# EAGLE design design1 (EAGLE 9.5.1)

## Sheet 1 of 3
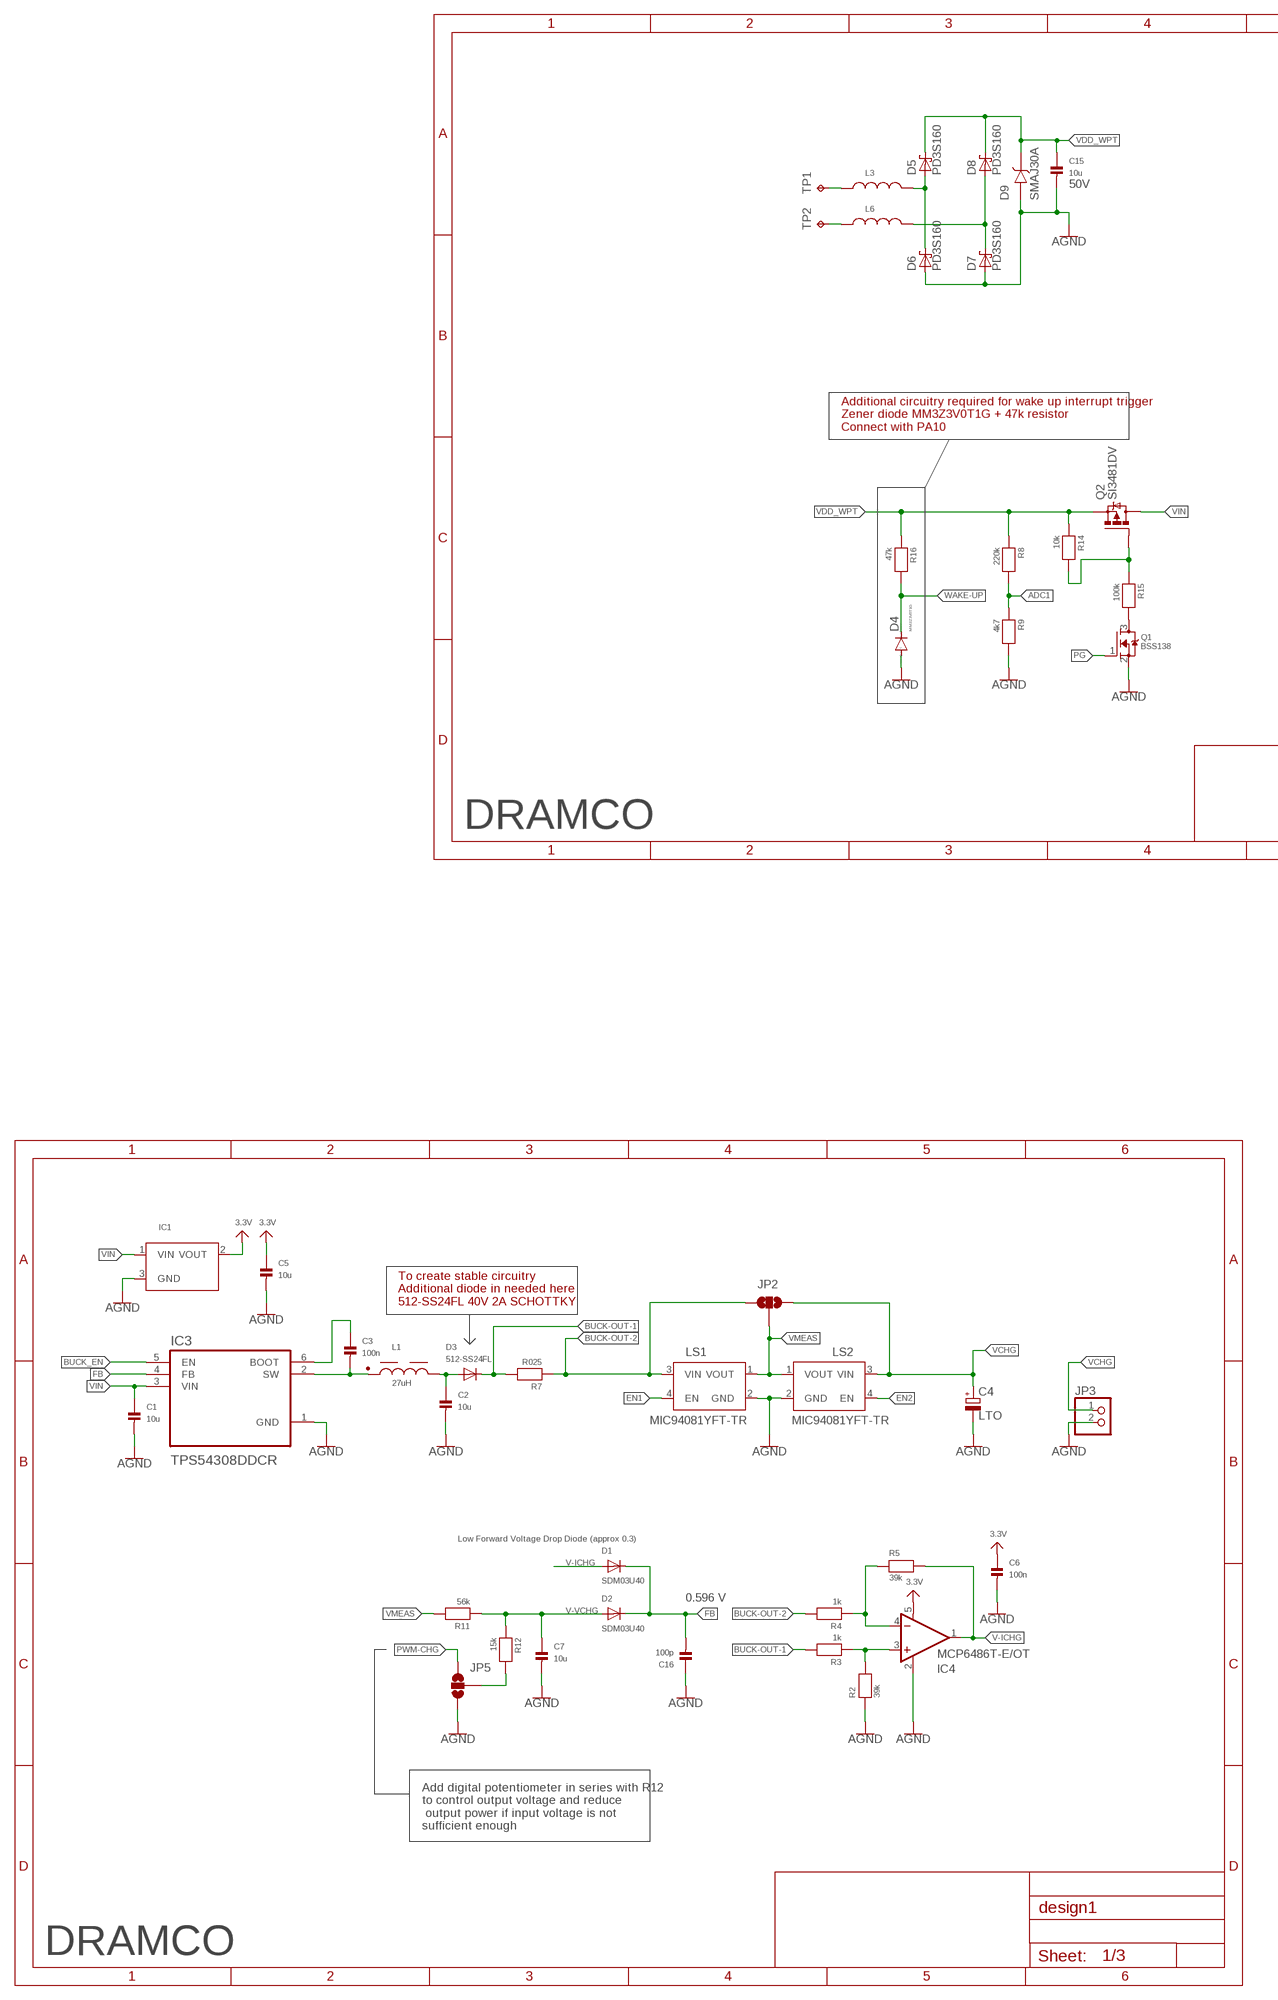
[diagram p0: schematic, sheet 1, part 1 of 2]
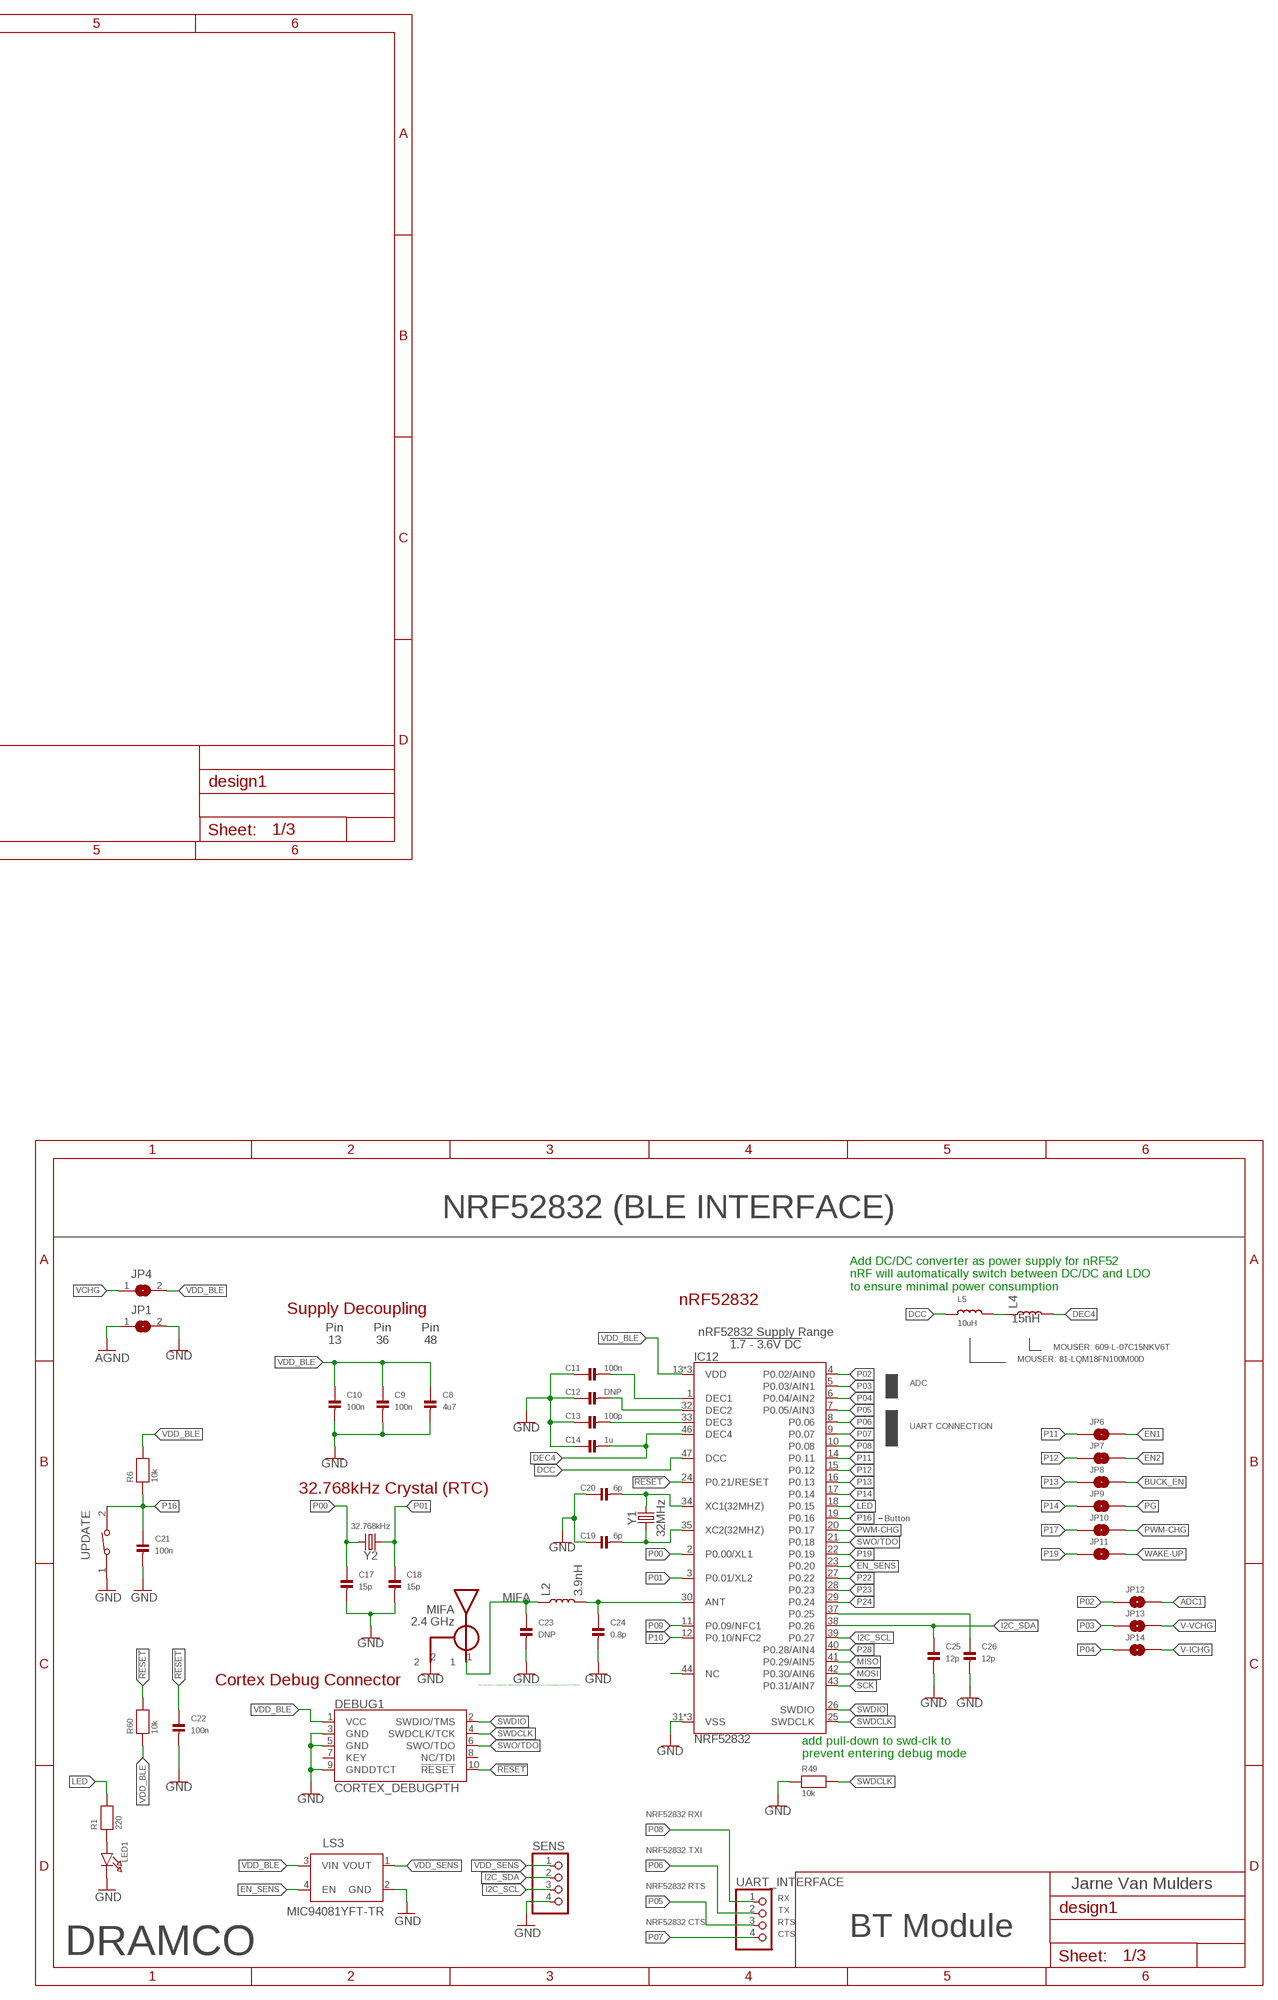
[diagram p1: schematic, sheet 1, part 2 of 2]

### Parts
C1  10u  CAP_CERAMIC0603  [0603]
C2  10u  CAP_CERAMIC0603  [0603]
C3  100n  CAP_CERAMIC0603  [0603]
C4  LTO  CPOL-EUE5-10.5  [E5-10,5]
C5  10u  CAP_CERAMIC0603  [0603]
C6  100n  CAP_CERAMIC0402  [0402]
C7  10u  CAP_CERAMIC0603  [0603]
C8  4u7  CAP_CERAMIC0603  [0603]
C9  100n  CAP_CERAMIC0402  [0402]
C10  100n  CAP_CERAMIC0402  [0402]
C11  100n  CAP_CERAMIC0402  [0402]
C12  DNP  CAP_CERAMIC0402  [0402]
C13  100p  CAP_CERAMIC0402  [0402]
C14  1u  CAP_CERAMIC0402  [0402]
C15  10u  CAP_CERAMIC1206  [1206]
C16  100p  CAP_CERAMIC0603  [0603]
C17  15p  CAP_CERAMIC0402  [0402]
C18  15p  CAP_CERAMIC0402  [0402]
C19  6p  CAP_CERAMIC0402  [0402]
C20  6p  CAP_CERAMIC0402  [0402]
C21  100n  CAP_CERAMIC0402  [0402]
C22  100n  CAP_CERAMIC0402  [0402]
C23  DNP  CAP_CERAMIC0402  [0402]
C24  0.8p  CAP_CERAMIC0402  [0402]
C25  12p  CAP_CERAMIC0402  [0402]
C26  12p  CAP_CERAMIC0402  [0402]
D1  SDM03U40  DIODESOD-523  [SOD-523]
D2  SDM03U40  DIODESOD-523  [SOD-523]
D3  512-SS24FL  DIODESOD-123  [SOD-123]
D4  MM3Z3V0T1G  DIODE-SOD323-R  [SOD323-R]
D5  PD3S160  [POWERDI323]
D6  PD3S160  [POWERDI323]
D7  PD3S160  [POWERDI323]
D8  PD3S160  [POWERDI323]
D9  SMAJ30A  [DIOM5026X229N]
DEBUG1  CORTEX_DEBUGPTH  [2X5-PTH-1.27MM]
IC1  VREG_SOT23  [SOT23-R]
IC3  TPS54308DDCR  [SOT95P280X110-6N]
IC4  MCP6486T-E/OT  MCP6291T-E/OT  [SOT23-5]
IC12  NRF52832  [QFN48-6X6MM]
JP1  SOLDERJUMPERREFLOW_NOPASTE  [SOLDERJUMPER_REFLOW_NOPASTE]
JP2  JUMPER-SMT_3_NO_NO-SILK  [SMT-JUMPER_3_NO_NO-SILK]
JP3  HEADER-1X2ROUND  [1X02_ROUND]
JP4  SOLDERJUMPERREFLOW_NOPASTE  [SOLDERJUMPER_REFLOW_NOPASTE]
JP5  JUMPER-SMT_3_NO_NO-SILK  [SMT-JUMPER_3_NO_NO-SILK]
JP6  JUMPER-SMT_2_NO_NO-SILK  [SMT-JUMPER_2_NO_NO-SILK]
JP7  JUMPER-SMT_2_NO_NO-SILK  [SMT-JUMPER_2_NO_NO-SILK]
JP8  JUMPER-SMT_2_NO_NO-SILK  [SMT-JUMPER_2_NO_NO-SILK]
JP9  JUMPER-SMT_2_NO_NO-SILK  [SMT-JUMPER_2_NO_NO-SILK]
JP10  JUMPER-SMT_2_NO_NO-SILK  [SMT-JUMPER_2_NO_NO-SILK]
JP11  JUMPER-SMT_2_NO_NO-SILK  [SMT-JUMPER_2_NO_NO-SILK]
JP12  JUMPER-SMT_2_NO_NO-SILK  [SMT-JUMPER_2_NO_NO-SILK]
JP13  JUMPER-SMT_2_NO_NO-SILK  [SMT-JUMPER_2_NO_NO-SILK]
JP14  JUMPER-SMT_2_NO_NO-SILK  [SMT-JUMPER_2_NO_NO-SILK]
L1  27uH  WE-PD_7332_PLASTIC_7447789127  [WE-PD_7332/7345_PLASTIC_BASE]
L2  3.9nH  INDUCTOR-0402-3.9NH  [0402]
L3  WE-CAIR_4248_744912182  [WE-CAIR_4248]
L4  15nH  INDUCTOR-0402-3.9NH  [0402]
L5  10uH  INDUCTOR_0603MP  [_0603MP]
L6  WE-CAIR_4248_744912182  [WE-CAIR_4248]
LED1  LED0805  [CHIPLED_0805]
LS1  MIC94081YFT-TR  [IC_MIC94081YFT-TR]
LS2  MIC94081YFT-TR  [IC_MIC94081YFT-TR]
LS3  MIC94081YFT-TR  [IC_MIC94081YFT-TR]
Q1  BSS138  MOSFET-NREFLOW  [SOT23-R]
Q2  SI3481DV  [TSOP-6.PAC]
R1  220  RESISTOR0603  [0603]
R2  39k  RESISTOR0603  [0603]
R3  1k  RESISTOR0603  [0603]
R4  1k  RESISTOR0603  [0603]
R5  39k  RESISTOR0603  [0603]
R6  10k  RESISTOR0402  [0402]
R7  R025  RESISTOR0603  [0603]
R8  220k  RESISTOR0603  [0603]
R9  4k7  RESISTOR0603  [0603]
R11  56k  RESISTOR0603  [0603]
R12  15k  RESISTOR0603  [0603]
R14  10k  RESISTOR0603  [0603]
R15  100k  RESISTOR0603  [0603]
R16  47k  RESISTOR0603  [0603]
R49  10k  RESISTOR0402  [0402]
R60  10k  RESISTOR0402  [0402]
SENS  HEADER-1X4ROUND  [1X04_ROUND]
TP1  TPTP20SQ  [TP20SQ]
TP2  TPTP20SQ  [TP20SQ]
U$18  BLE-ANT  [ANT-2G4]
UART_INTERFACE  HEADER-1X4ROUND  [1X04_ROUND]
UPDATE  434111043826  [434111043826]
Y1  32MHz  CRYSTAL-32MHZ-SMD-2.0X1.6MM  [CRYSTAL-SMD-2.0X1.6MM]
Y2  32.768kHz  CRYSTAL-32.768KHZSMD-3.2X1.5  [CRYSTAL-SMD-3.2X1.5MM]

### Nets
3.3V: C5.1 C6.1 IC1.2(VOUT) IC4.5(V+)
!RESET!: C22.1 DEBUG1.10(!RESET) IC12.24(P0.21/RESET) R60.2
ADC1: JP12.2 R8.2 R9.1
AGND: C1.2 C2.2 C4.- C5.2 C6.2 C7.2 C15.2 C16.1 D4.A D6.A D7.A D9.A IC1.3(GND) IC3.1(GND) IC4.2(V-) JP1.1 JP3.2 JP5.1 LS1.2(GND) LS2.2(GND) Q1.2(S) R2.1 R9.2
ANT: C24.1 IC12.30(ANT) L2.2
BUCK-OUT-1: D3.C R3.2 R7.2
BUCK-OUT-2: JP2.1 LS1.3(VIN) R4.2 R7.1
BUCK_EN: IC3.5(EN) JP8.2
DCC: IC12.47(DCC) L5.1
DEC4: C14.2 IC12.46(DEC4) L4.2
DEC5: C11.2 IC12.1(DEC1)
DEC6: C12.2 IC12.32(DEC2)
DEC8: C13.2 IC12.33(DEC3)
EN1: JP6.2 LS1.4(EN)
EN2: JP7.2 LS2.4(EN)
EN_SENS: IC12.23(P0.20) LS3.4(EN)
FB: C16.2 D1.K(C) D2.K(C) IC3.4(FB)
GND: C8.2 C9.2 C10.2 C11.1 C12.1 C13.1 C14.1 C17.2 C18.2 C19.1 C20.1 C21.2 C22.2 C23.2 C24.2 C25.2 C26.2 DEBUG1.3(GND) DEBUG1.5(GND) DEBUG1.9(GNDDTCT) IC12.31(VSS) IC12.45(VSS) IC12.EP(VSS) JP1.2 LED1.C LS3.2(GND) R49.1 SENS.4 U$18.2 UPDATE.1
I2C_SCL: IC12.39(P0.27) SENS.3
I2C_SDA: C25.1 IC12.38(P0.26) SENS.2
LED: IC12.18(P0.15) R1.2
MIFA: C23.1 L2.1 U$18.1
MISO: IC12.41(P0.29/AIN5)
MOSI: IC12.42(P0.30/AIN6)
N$2: C3.1 IC3.6(BOOT)
N$3: C3.2 IC3.2(SW) L1.1
N$4: Q1.3(D) R15.2
N$5: Q2.3(G) R14.2 R15.1
N$6: JP5.2 R12.2
N$8: IC4.4(-IN) R4.1 R5.1
N$9: IC4.3(+IN) R2.2 R3.1
N$12: L6.1 TP2.TP
N$13: C2.1 D3.A L1.2
N$14: L3.1 TP1.TP
N$15: D5.A D6.C L3.2
N$16: D7.C D8.A L6.2
N$20: LED1.A R1.1
N$50: C26.1 IC12.37(P0.25)
N$53: L4.1 L5.2
NC: IC12.44(NC)
P00: C17.1 IC12.2(P0.00/XL1) Y2.P$2
P01: C18.1 IC12.3(P0.01/XL2) Y2.P$1
P02: IC12.4(P0.02/AIN0) JP12.1
P03: IC12.5(P0.03/AIN1) JP13.1
P04: IC12.6(P0.04/AIN2) JP14.1
P05: IC12.7(P0.05/AIN3) UART_INTERFACE.3
P06: IC12.8(P0.06) UART_INTERFACE.2
P07: IC12.9(P0.07) UART_INTERFACE.4
P08: IC12.10(P0.08) UART_INTERFACE.1
P09: IC12.11(P0.09/NFC1)
P10: IC12.12(P0.10/NFC2)
P11: IC12.14(P0.11) JP6.1
P12: IC12.15(P0.12) JP7.1
P13: IC12.16(P0.13) JP8.1
P14: IC12.17(P0.14) JP9.1
P16: C21.1 IC12.19(P0.16) R6.1 UPDATE.2
P17: JP10.1
P19: IC12.22(P0.19) JP11.1
P22: IC12.27(P0.22)
P23: IC12.28(P0.23)
P24: IC12.29(P0.24)
P28: IC12.40(P0.28/AIN4)
PG: JP9.2 Q1.1(G)
PWM-CHG: IC12.20(P0.17) JP5.3 JP10.2
SCK: IC12.43(P0.31/AIN7)
SWDCLK: DEBUG1.4(SWDCLK/TCK) IC12.25(SWDCLK) R49.2
SWDIO: DEBUG1.2(SWDIO/TMS) IC12.26(SWDIO)
SWO/TDO: DEBUG1.6(SWO/TDO) IC12.21(P0.18)
V-ICHG: D1.A IC4.1(OUT) JP14.2 R5.2
V-VCHG: C7.1 D2.A JP13.2 R11.1 R12.1
VCHG: C4.+ JP2.3 JP3.1 JP4.1 LS2.3(VIN)
VDD_BLE: C8.1 C9.1 C10.1 DEBUG1.1(VCC) IC12.13(VDD) IC12.36(VDD) IC12.48(VDD) JP4.2 LS3.3(VIN) R6.2 R60.1
VDD_SENS: LS3.1(VOUT) SENS.1
VDD_WPT: C15.1 D5.C D8.C D9.C Q2.4(S) R8.1 R14.1 R16.1
VIN: C1.1 IC1.1(VIN) IC3.3(VIN) Q2.1(D) Q2.2(D) Q2.5(D) Q2.6(D)
VMEAS: JP2.2 LS1.1(VOUT) LS2.1(VOUT) R11.2
WAKE-UP: D4.C JP11.2 R16.2
XC1: C20.2 IC12.34(XC1(32MHZ)) Y1.3
XC2: C19.2 IC12.35(XC2(32MHZ)) Y1.1
Unconnected: DEBUG1.7(KEY) DEBUG1.8(NC/TDI)

### Notes on the sheet
- 50V
- Additional circuitry required for wake up interrupt trigger
  Zener diode MM3Z3V0T1G + 47k resistor
  Connect with PA10
- DRAMCO
- NRF52832 (BLE INTERFACE)
- Add DC/DC converter as power supply for nRF52
  nRF will automatically switch between DC/DC and LDO
  to ensure minimal power consumption
- To create stable circuitry
  Additional diode in needed here
  512-SS24FL 40V 2A SCHOTTKY
- nRF52832
- Supply Decoupling
- nRF52832 Supply Range
  !1.7 - 3.6V DC!
- Pin
  13
- Pin
  36
- Pin
  48
- MOUSER: 609-L-07C15NKV6T
- MOUSER: 81-LQM18FN100M00D
- ADC
- UART CONNECTION
- 32.768kHz Crystal (RTC)
- Button
- Low Forward Voltage Drop Diode (approx 0.3)
- 0.596 V
- Cortex Debug Connector | https://www.infineon.com/dgdl/Infineon-AN91445_Antenna_Design_and_RF_Layout_Guidelines-ApplicationNotes-v09_00-EN.pdf
- add pull-down to swd-clk to 
  prevent entering debug mode
- NRF52832 RXI
- Add digital potentiometer in series with R12 
  to control output voltage and reduce
   output power if input voltage is not 
  sufficient enough
- NRF52832 TXI
- NRF52832 RTS | Jarne Van Mulders
- RX
- TX
- NRF52832 CTS | RTS
- CTS | BT Module
- DRAMCO | DRAMCO

## Sheet 2 of 3

## Sheet 3 of 3

## Library data of the parts
C1-C3 C5-C26 = microbuilder:CAP_CERAMIC: Ceramic Capacitors 0402 - 0402 Surface Mount Capacitors 16pF 50V 5% [Digikey: 445-4899-2-ND] 18pF 50V 5% [Digikey: 490-1281-2-ND] 22pF 50V 5% [Digikey: 490-1283-2-ND] 68pF 50V 5% [Digikey: 490-1289-2-ND] 0.1uF 10V 10% [Digikey: 490-1318-2-ND] 1.0uF 6.3V 10% [Digikey: 490-1320-2-ND] 0603 - 0603 Surface Mount Capacitors 16 pF 50V 5% [Digikey: 445-5051-2-ND] 22 pF 50V [Digikey: PCC220ACVTR-ND] 33 pF 50V 5% [Digikey: 490-1415-1-ND] 56pF 50V 5% [Digikey: 490-1421-1-ND] 220pF 50V 5% [Digikey: 445-1285-1-ND] 680 pF 50V 2200 pF 50V 5% C0G [Digikey: 445-1297-1-ND] 5600 pF 100V 5% X7R [Digikey: 478-3711-1-ND] 0.1 µF 25V 10% [Digikey: PCC2277TR-ND] 0.22 µF 16V 10% X7R [Digikey: 445-1318-1-ND] 1.0 µF 25V 10% [Digikey: 445-5146-2-ND] 0603 - RF Specific 3pF 250V +/-0.1pF RF [Digikey: 712-1347-1-ND] 18 pF 250V 5% [Digikey: 478-3505-1-ND or 712-1322-1-ND] 56 pF 250V 5% C0G RF [Digikey: 490-4867-1-ND] 68 pF 250V RF [Digikey: 490-4868-1-ND] 0805 - 0805 Surface Mount Capacitors 220 pF 250V 2% RF Ceramic Capacitor [Digikey: 712-1398-1-ND] 1000 pF 50V 2% NP0 Ceramic Capacitor [Digikey: 478-3760-1-ND] 0.1 µF 25V 10% Ceramic Capacitor [Digikey: PCC1828TR-ND] 1.0 µF 16V 10% Ceramic Capacitor[Digikey: 490-1691-2-ND] 10.0 µF 10V 10% Ceramic Capacitor[Digikey: 709-1228-1-ND] 10.0 uF 16V 10% Ceramic Capacitor [Digikey: 478-5165-2-ND] 47 uF 6.3V 20% Ceramic Capacitor [Digikey: 587-1779-1-ND or 399-5506-1-ND] 1206 - 1206 Surface Mount Capacitors 47uF 10V 20% Ceramic Capacitor [Digikey: 490-5528-1-ND or 399-5508-1-ND or 445-6010-1-ND] 100uF 6.3V -20%, +80% Y5V Ceramic Capacitor (Digikey: 490-4512-1-ND, Mouser: 81-GRM31CF50J107ZE1L)
C4 = rcl:CPOL-EU: POLARIZED CAPACITOR, European symbol
D1-D3 = microbuilder:DIODE: Diode SMA Model Volts Amps Type Vf Vr Digikey # Notes SSA34-E3 40V 3A Schottky 480mV @ 3A 200uA @ 40V SSA34-E3/61TGITR-ND CDBA120-G 20V 1A Schottky 500mV @ 1A 500uA @ 20V 641-1014-6-ND REEL MBRA210 10V 2A Schottky 350mV @ 2A 700uA @ 10V MBRA210LT3 SOD-123 Model Volts Amps Type Vf Vr Order # Notes BAT54T1G 30V 200mA Schottky 800mV @ 200mA 2uA @ 25V BAT54T1GOSTR-ND B0530W 30V 500mA Schottky 430mV @ 500mA 130uA @ 30V B0530W-FDICT-ND REEL MBR120 1A 20V Schottky 340mV @ 1A MBR120VLSFT1GOSCT-ND SOD-323 Model Volts Amps Type Vf Vr Order # Notes PMEG2005EJ 20V 500mA Schottky 355mV @ 500mA 568-4110-1-ND ZLLS410 10V 570mA Schottky 380mV @ 570mA ZLLS410CT-ND 1N4148WS 75V 150mA Silicon/Simple 1V 1N4148WSFSCT-ND REEL SOD-523 Model Volts Amps Type Vf Vr Order # Notes BAT54XV2 30V 200mA Schottky 0.8V @ 100mA BAT54XV2CT-ND TB751S 30V 30mA Schottky RB751S-40TE61CT-ND SOT23-R/W (R = Solder Paste/Reflow Ovens, W = Hand-Soldering) Model Volts Amps Type Vf Vr Order # Notes BAT54FILM 40V 300mA Schottky 497-7162-1-ND
D4 = diode:DIODE-: DIODE
D5-D8 = diode:PD3S160: 1.0A SURFACE MOUNT SCHOTTKY BARRIER RECTIFIER POWERDI ® 323 Source: http://www.diodes.com/datasheets/ds30899.pdf
D9 = SMAJ30A:SMAJ30A: SMAJ Series 48.4 V 0.4 kW Surface Mount Uni-Directional TVS Diode - DO-214AC Check prices <https://pricing.snapeda.com/parts/SMAJ30A/Littelfuse/view-part?ref=eda>; AVAILABILITY: Good; DESCRIPTION: 48.4V Clamp 8.3A Ipp Tvs Diode Surface Mount DO-214AC (SMA); MF: Littelfuse; MP: SMAJ30A; PACKAGE: DO-214 Littelfuse; PRICE: None; PURCHASE-URL: https://pricing.snapeda.com/search/part/SMAJ30A/?ref=eda
DEBUG1 = SparkFun-Connectors:CORTEX_DEBUG: Cortex Debug Connector Datasheet <http://infocenter.arm.com/help/topic/com.arm.doc.faqs/attached/13634/cortex_debug_connectors.pdf>
IC1 = microbuilder:VREG_SOT23: SOT23 Fixed Voltage Regulators Part Current Out V Out V In V Dropout Digikey Part No. AP7313 150mA 3.3V 3.5-6V 0.15V @ 150mA AP7313-33SAG-7DICT-ND
IC3 = TPS54308DDCR:TPS54308DDCR: Check availability <https://pricing.snapeda.com/parts/TPS54308DDCR/Texas%20Instruments/view-part?ref=eda>; AVAILABILITY: In Stock; DESCRIPTION: 4.5-V to 28-V Input, 3-A output, synchronous 350-kHz FCCM step-down converter; MF: Texas Instruments; MP: TPS54308DDCR; PACKAGE: SOT-23-THN-6 Texas Instruments; PRICE: None; PURCHASE-URL: https://pricing.snapeda.com/search/part/TPS54308DDCR/?ref=eda
IC4 = SparkFun-Retired:MCP6291: Rail to rail OpAmp with 10MHz GBP Prototype: IC-11991; PROD_ID: IC-11991; VALUE: MCP6291T
IC12 = SparkFun-RF:NRF52832: Nordic nRF52832 Bluetooth Smart/ANT/2.4GHz RF SoC The nRF52832 SoC is a powerful, highly flexible ultra-low power multiprotocol SoC ideally suited for Bluetooth® Smart ANT and 2.4GHz ultra low-power wireless applications. The nRF52832 SoC is built around a 32-bit ARM® Cortex™-M4F CPU with 512kB + 64kB RAM. The embedded 2.4GHz transceiver supports Bluetooth Smart, ANT and proprietary 2.4 GHz protocol stack. It is on air compatible with the nRF51 Series, nRF24L and nRF24AP Series products from Nordic Semiconductor. Datasheet <https://cdn.sparkfun.com/datasheets/Wireless/Bluetooth/nRF52832_PS_v1.0.pdf> SparkFun Products: SparkFun nRF52832 Breakout <https://www.sparkfun.com/products/13990>; PROD_ID: IC-13460
JP1 JP4 = microbuilder:SOLDERJUMPER: SMD Solder JUMPER Solder the two pads together to create a connection, or remove the solder to break it. REFLOW - Use this footprint for solder paste and reflow ovens. WAVE - Use this footprint for hand-soldering (larger pads). CLOSED - Has a trace between the two pads to ensure it is closed by default. The trace needs to be cut to disable the jumper, and can be closed again by creating a solder bridge between the two pads.
JP2 JP5 = SparkFun-Jumpers:JUMPER-SMT_3_NO: Normally open jumper This jumper has three pads in close proximity to each other. Apply solder to close the connection(s).
JP3 = microbuilder:HEADER-1X2: PIN HEADER
JP6-JP14 = SparkFun-Jumpers:JUMPER-SMT_2_NO: Normally open jumper This jumper has two pads in close proximity to each other. Apply solder to close the connection. Round pads are easier to solder for beginners, but are a lot larger. SparkFun Product that uses the round pads: SparkFun EL Sequencer <https://www.sparkfun.com/products/12781>
L1 = EMCComponents (rev19b):WE-PD_7332_PLASTIC: SMD Shielded Power Inductor Characteristics Magnetically shielded version which results in a low leakage field High Saturation currents up to 25 A Very low self-losses at high switching frequency‘s Wide inductances spectrum available at all sizes Operating temperature: –40 °C to +125 °C Applications Perfectly suitable for switching regulators with extremely high efficiency Integrated DC/DC- converter Switching regulators with low operating voltages (Graphic cards, embedded PC-Cards, Mainboards) Plastic base: Because of the one piece construction these are more suitable for high vibration or shock applications <http://katalog.we-online.de/media/images/v2/Family_WE-PD.jpg> Details see: http://katalog.we-online.de/en/pbs/WE-PD? Updated by Dan Xu 2014-07-08 2014 (C) Wurth Elektronik; WE-NUMBER: 7447789127/27uH
L2 = nrf52832-breakout-temp:INDUCTOR: Inductors; PROD_ID: NDUC-13457
L3 L6 = PowerMagnetics (rev18e):WE-CAIR_4248: WE-CAIR Air coil Characteristics Inductance values from 1.65nH up to 120 nH Very high quality factor >100 High self-resonant frequency High currents up to 3.5 A 5%(10%) Inductance tolerance Pick and place process possible Good solderability (Tinned connector pins) Operating temperature: –40 °C to +125 °C Applications Especially for RF application Ideal for high current applications Broad band filter RF-Decoupling <http://katalog.we-online.de/media/images/v2/Family_WE-CAIR_4C.jpg> Details see: http://katalog.we-online.de/en/pbs/WE-CAIR Created on 2014-05-19 2014 (C) Wurth Elektronik; WE-NUMBER: 744912182/82nH
L4 = nrf52832-breakout-temp:INDUCTOR: Inductors; PROD_ID: NDUC-13457; VALUE: 3.9nH
L5 = microbuilder:INDUCTOR: Inductors
LED1 = microbuilder:LED: LED 0603 - 0603 Surface Mount Package 2mA: Green LED - Low Power (3.9mcd, 2ma, 1.7Vf) - Digikey: 475-2709-2-ND Orange LED - Low Power (9.8mcd, 2ma, 1.8Vf) - Digikey: 475-1194-2-ND Red LED - Low Power (5mcd, 2ma, 1.8Vf) - Digikey: 475-1195-2-ND Yellow LED - Low Power (7mcd, 2ma, 1.8Vf) - Digikey: 475-1196-2-ND 5mA: Blue LED - Low Power (17mcd, 5ma, 2.9Vf) - Digikey: LNJ937W8CRACT-ND 0805 - 0805 Surface Mount Package 2mA: Red LED (8.8mcd, 2mA, 1.8Vf, Clear) - Low Power [Digikey: 475-2510-1-ND] Green LED (5mcd, 2mA, 1.8Vf, Clear) - Low Power [Digikey: 475-2730-1-ND] Yellow LED (11.3mcd, 2mA, 1.8Vf, Clear) - Low Power [Digikey: 475-2555-1-ND] 20mA: Red LED (104mcd, 20mA, Diffused) - LS R976 [Digikey: 475-1278-6-ND] Red LED (12mcd, 20mA, 2.0Vf, Clear) - APT2012EC [Digikey: 754-1128-1-ND] Green LED (15mcd, 20mA, 2.2Vf, Clear) - APT2012GC [Digikey: 754-1131-1-ND] Orange LED (160mcd, 20mA, 2.1Vf, Clear) - APT2012SECK [Digikey: 754-1130-1-ND] 1206 - 1206 Surface Mount Package Green LED (26mcd, 20mA, Diffused) - LG N971 [Digikey: 475-1407-6-ND] Red LED (15mcd, 20mA, Diffused) - LH N974 [Digikey: 475-1416-6-ND]
LS1-LS3 = MIC94081YFT-TR:MIC94081YFT-TR: Power Switch/Driver 1:1 P-Channel 2A 4-TMLF® (0.85x0.85) Check prices <https://pricing.snapeda.com/parts/MIC94081YFT-TR/Microchip/view-part?ref=eda>; AVAILABILITY: In Stock; DESCRIPTION: Power Switch/Driver 1:1 P-Channel 2A 4-TMLF® (0.85x0.85); MF: Microchip; MP: MIC94081YFT-TR; PACKAGE: UFDFN-4 Microchip; PRICE: None
Q1 = microbuilder:MOSFET-N: N-Channel Mosfet LEGEND VDS: Voltage Drain-Source ID: Drain Current RDS(ON): Drain-Source On-State Resistance VGS(TH): Gate-Source Threshold Voltage CISS: Drain-Source Input Capacitance SOT-23 Name VDS ID RDS(ON) VGS(TH) CISS Order Number 2N7002E 60V 260mA 2.5 Ohm 2.5V @ 250uA 26.7pF @ 25V 2N7002ET1GOSTR-ND BSH103 30V 850mA 400 mOhm 400mV @ 1mA 83pF @ 24V BSH103,235-ND BSS138 60V 320mA 1.6 Ohm 1.5V @ 250uA 50pF @ 10V Mouser: 771-BSS138PW115 DMN2075U-7 20V 4.2A 38 mOhm 1V @ 250 uA 594.3pF @ 10V DMN2075U-7DICT-ND * BSS138 good choice for I2C level-shifting
Q2 = transistor-power:SI3481DV: P-Channel 30-V (D-S) MOSFET Source: http://www.vishay.com/docs/72105/72105.pdf
R1-R9 R11 R12 R14-R16 R49 R60 = microbuilder:RESISTOR: Resistors 0402 - 0402 Surface Mount Package 22 Ohm 1% 1/16W [Digikey: 311-22.0LRTR-ND] 33 Ohm 5% 1/16W 1.0K 5% 1/16W 1.5K 5% 1/16W 2.0K 1% 1/16W 10.0K 1% 1/16W [Digikey: 311-10.0KLRTR-ND] 10.0K 5% 1/16W [Digikey: RMCF0402JT10K0TR-ND] 12.1K 1% 1/16W [Digikey: 311-22.0LRTR-ND] 100.0K 5% 1/16W 0603 - 0603 Surface Mount Package 0 Ohm 1/10 Watt 1% Resistor 15 Ohm 1/10 Watt 1% Resistor 33 Ohm 1/10 Watt 1% Resistor 49.9 Ohm 1/10 Watt 1% Resistor 100 Ohm 1/10 Watt 1% Resistor 150 Ohm 1/10 Watt 1% Resistor 240 Ohm 1/10 Watt 1% Resistor 390 Ohm 1/10 Watt 1% Resistor 560 Ohm 1/10 Watt 1% Resistor 680 Ohm 1/10 Watt 1% Resistor 750 Ohm 1/10 Watt 1% Resistor 1.0K Ohm 1/10 Watt 1% Resistor 1.5K Ohm 1/10 Watt 1% Resistor 2.0K Ohm 1/10 Watt 1% Resistor 2.2K Ohm 1/10 Watt 1% Resistor 3.3K Ohm 1/10 Watt 1% Resistor 4.7K Ohm 1/10 Watt 1% Resistor 10.0K Ohm 1/10 Watt 1% Resistor 12.0K Ohm 1/10 Watt 1% Resistor 12.1K Ohm 1/10 Watt 1% Resistor 20.0K Ohm 1/10 Watt 1% Resistor 33.0K Ohm 1/10 Watt 1% Resistor 100.0K Ohm 1/10 Watt 1% Resistor 0805 - 0805 Surface Mount Package 0 Ohm 1/8 Watt 1% Resistor 33 Ohm 1/8 Watt 1% Resistor 100 Ohm 1/8 Watt 1% Resistor 150 Ohm 1/8 Watt 1% Resistor 200 Ohm 1/8 Watt 1% Resistor 240 Ohm 1/8 Watt 1% Resistor 330 Ohm 1/8 Watt 1% Resistor 390 Ohm 1/8 Watt 1% Resistor 470 Ohm 1/8 Watt 1% Resistor 1.0K Ohm 1/8 Watt 1% Resistor 1.5K Ohm 1/8 Watt 1% Resistor 2.0K Ohm 1/8 Watt 1% Resistor 4.7K Ohm 1/8 Watt 1% Resistor 5.1K Ohm 1/8 Watt 1% Resistor 5.6K Ohm 1/8 Watt 1% Resistor 10.0K Ohm 1/8 Watt 1% Resistor 22.0K Ohm 1/8 Watt 1% Resistor 33.0K Ohm 1/8 Watt 1% Resistor 100K Ohm 1/8 Watt 1% Resistor 1206 - 1206 Surface Mount Package 2012 - 2010 Surface Mount Package 0.11 Ohm 1/2 Watt 1% Resistor - Digikey: RHM.11UCT-ND
SENS UART_INTERFACE = microbuilder:HEADER-1X4: PIN HEADER
TP1 TP2 = testpad:TP: Test pad
U$18 = ble-antenna:BLE-ANT
UPDATE = Eagle_SWITCHES (rev18c):434111043826: 6.0x3.5 mm SMD WS-TASV <http://katalog.we-online.de/media/images/v2/Family_WS-TASV_6.0x3.jpg> Details see: http://katalog.we-online.de/em/datasheet/4341x1xxx8x6.pdf 2015 (C) Wurth Elektronik
Y1 = nrf52832-breakout-temp:CRYSTAL-32MHZ: 32MHz Crystal Digikey Example <http://www.digikey.com/product-detail/en/murata-electronics-north-america/XRCGB32M000F2P00R0/490-9769-1-ND/4952013> Frequency: 32MHz Frequency Stability: ±20ppm Frequency Tolerance: ±20ppm Load Capacitance: 6pF; PROD_ID: XTAL-13459
Y2 = SparkFun-Clocks:CRYSTAL-32.768KHZ: 32.768kHz Crystal Frequency: 32.768kHz Frequency Stability: ±20ppm Load Capacitance: 12.5pF (PTH-2X6 & SMD-3.2X1.5), 6pF (SMD-2X6); PROD_ID: XTAL-13062

## Board
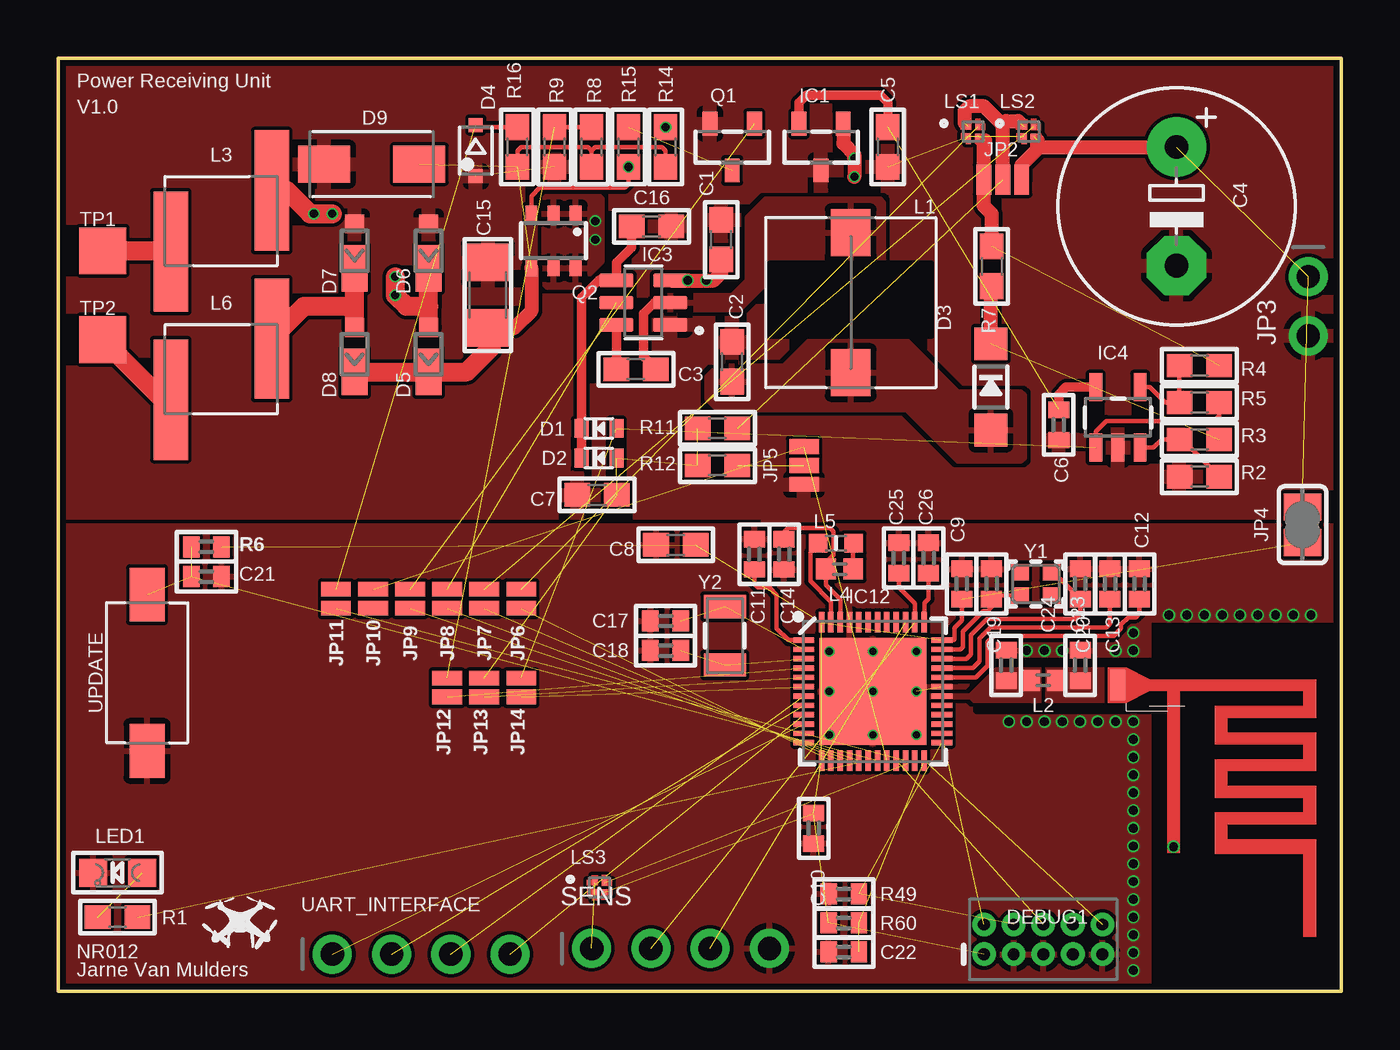
[diagram p2: board, top side]
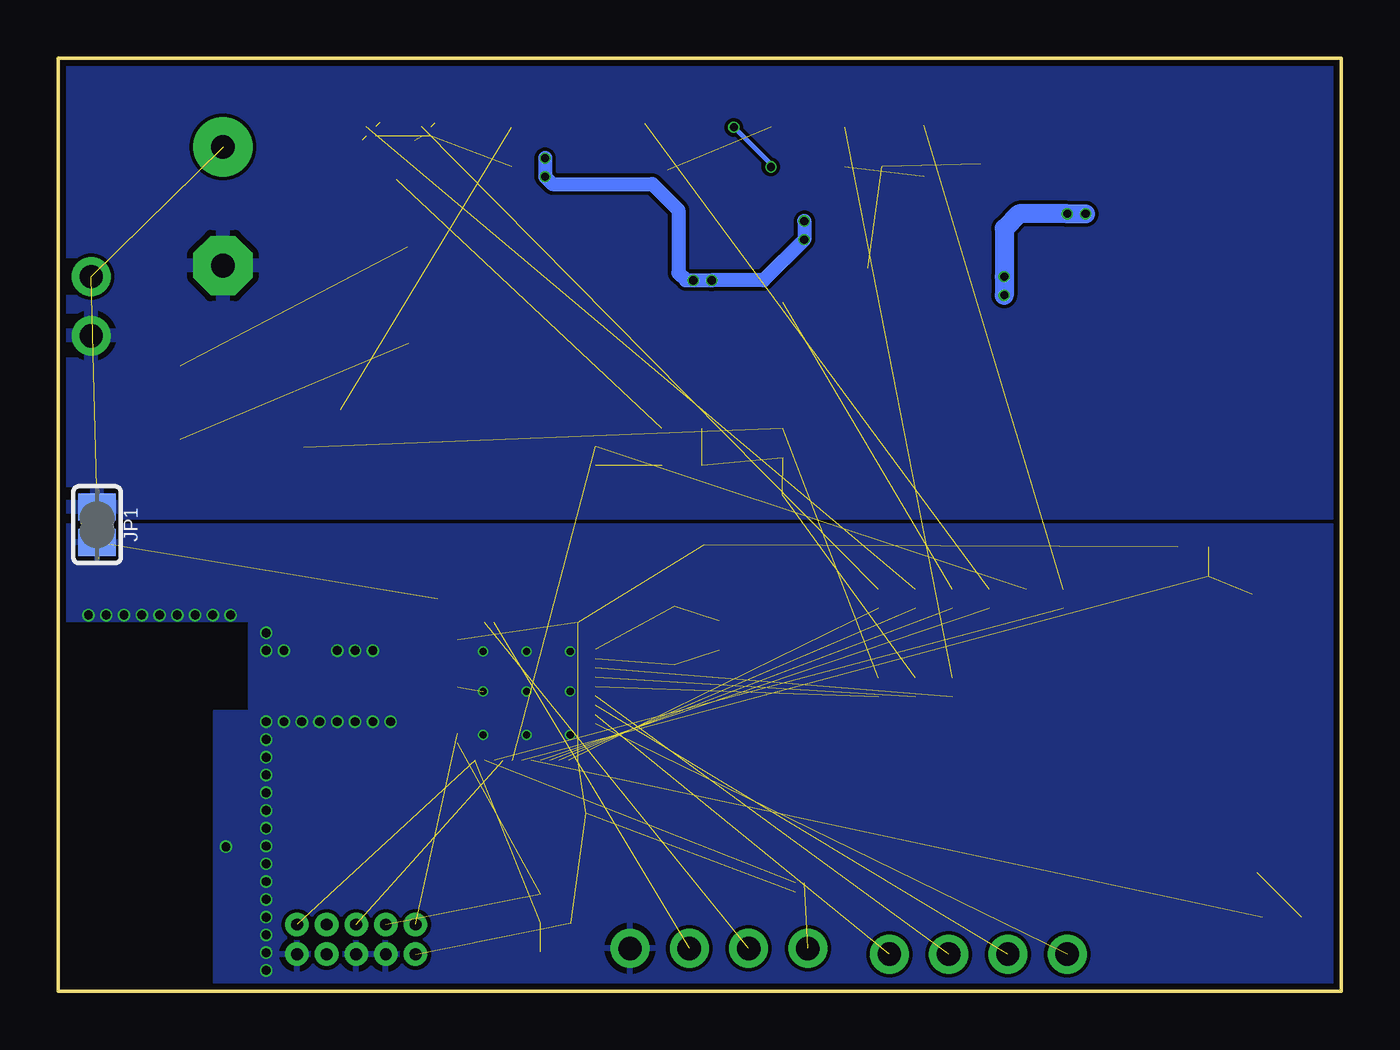
[diagram p3: board, bottom side, seen from below]

Size 55 x 40 mm. Coordinates in mm from the lower left corner, seen from the top.
Outline: 0,0 0,40 55,40 55,0 0,0
Copper layers (1*16): Top 0.035mm / dielectric 1.5mm / Bottom 0.035mm
Design rules "SeeedStudio_2layer_DRU_no_angle_20140221-2 *": minimum track width 6mil, minimum drill 12mil, track to track 6mil, track to pad 6mil, pad to pad 6mil, via to via 6mil, smd to smd 0mil, copper to edge 10mil, drill to drill 10mil, minimum pad ring 10mil, minimum via ring 2mil, stop-mask expansion 2mil, vias tented up to drill 100mil, thermal gap 10mil
tRestrict: area 39.4,12 to 46.8,12.1; area 40,14.1 to 46.8,14.2

### Footprints (pad centres in the part's own frame; a part is rotated, then mirrored left to right if it is on the bottom)
0603 = smd 1.1 x 1: 1 -0.85,0; 2 0.85,0
E5-10,5 = drill 1.016 pad 2.54: + -2.54,0 | drill 1.016 pad 2.54 octagon: - 2.54,0
0402 = smd 0.7 x 0.9: 1 -0.65,0; 2 0.65,0
1206 = smd 1.6 x 1.8: 1 -1.4,0; 2 1.4,0
SOD-523 = smd 0.8 x 0.6: A 0,-0.75; K 0,0.75
SOD-123 = smd 1.4 x 1.4: A 1.85,0; C -1.85,0
SOD323-R = smd 0.6 x 0.6: A 1.1,0; C -1.1,0
POWERDI323 = smd 0.8 x 0.8: A 1.15,0 | smd 2 x 1.1: C -0.75,0
DIOM5026X229N = smd 2.22 x 1.57: A 2.04,0; C -2.04,0
2X5-PTH-1.27MM = drill 0.508 pad 1: 1 -2.54,-0.635; 2 -2.54,0.635; 3 -1.27,-0.635; 4 -1.27,0.635; 5 0,-0.635; 6 0,0.635; 7 1.27,-0.635; 8 1.27,0.635; 9 2.54,-0.635; 10 2.54,0.635
SOT23-R = smd 0.635 x 1.016: 1 -0.95,-1; 2 0.95,-1; 3 0,1
SOT95P280X110-6N = smd 1.45 x 0.59: 1 -1.155,0.95; 2 -1.155,0; 3 -1.155,-0.95; 4 1.155,-0.95; 5 1.155,0; 6 1.155,0.95
SOT23-5 = smd 0.55 x 1.2: 1 -0.95,-1.3; 2 0,-1.3; 3 0.95,-1.3; 4 0.95,1.3; 5 -0.95,1.3
QFN48-6X6MM = smd 0.88 x 0.23: 1 -2.96,2.2; 2 -2.96,1.8; 3 -2.96,1.4; 4 -2.96,1; 5 -2.96,0.6; 6 -2.96,0.2; 7 -2.96,-0.2; 8 -2.96,-0.6; 9 -2.96,-1; 10 -2.96,-1.4; 11 -2.96,-1.8; 12 -2.96,-2.2; 25 2.96,-2.2; 26 2.96,-1.8; 27 2.96,-1.4; 28 2.96,-1; 29 2.96,-0.6; 30 2.96,-0.2; 31 2.96,0.2; 32 2.96,0.6; 33 2.96,1; 34 2.96,1.4; 35 2.96,1.8; 36 2.96,2.2 | smd 0.23 x 0.88: 13 -2.2,-2.96; 14 -1.8,-2.96; 15 -1.4,-2.96; 16 -1,-2.96; 17 -0.6,-2.96; 18 -0.2,-2.96; 19 0.2,-2.96; 20 0.6,-2.96; 21 1,-2.96; 22 1.4,-2.96; 23 1.8,-2.96; 24 2.2,-2.96; 37 2.2,2.96; 38 1.8,2.96; 39 1.4,2.96; 40 1,2.96; 41 0.6,2.96; 42 0.2,2.96; 43 -0.2,2.96; 44 -0.6,2.96; 45 -1,2.96; 46 -1.4,2.96; 47 -1.8,2.96; 48 -2.2,2.96 | smd 4.6 x 4.6: EP 0,0
SOLDERJUMPER_REFLOW_NOPASTE = smd 1.168 x 1.6: 1 -0.762,0; 2 0.762,0
SMT-JUMPER_3_NO_NO-SILK = smd 0.635 x 1.27: 1 -0.813,0; 2 0,0; 3 0.813,0
1X02_ROUND = drill 1 pad 1.676: 1 -1.27,0; 2 1.27,0
SMT-JUMPER_2_NO_NO-SILK = smd 0.635 x 1.27: 1 -0.406,0; 2 0.406,0
WE-PD_7332/7345_PLASTIC_BASE = smd 2 x 1.7: 1 -3,0; 2 3,0
0402' = smd 0.85 x 0.9: 1 -0.58,0; 2 0.58,0
WE-CAIR_4248 = smd 1.48 x 5.16: 1 -2.165,-1.31; 2 2.165,1.31
_0603MP = smd 0.8 x 0.8: 1 -0.762,0; 2 0.762,0
CHIPLED_0805 = smd 1.2 x 1.2: A 0,-1.05; C 0,1.05
IC_MIC94081YFT-TR = smd 0.2 x 0.2: 1 -0.2,0.2; 2 -0.2,-0.2; 3 0.2,-0.2; 4 0.2,0.2
TSOP-6.PAC = smd 0.508 x 0.7: 1 -0.95,-1.163; 2 0,-1.163; 3 0.95,-1.163; 4 0.95,1.163; 5 0,1.163; 6 -0.95,1.163
1X04_ROUND = drill 1 pad 1.676: 1 -3.81,0; 2 -1.27,0; 3 1.27,0; 4 3.81,0
TP20SQ = smd 2 x 2: TP 0,0
ANT-2G4 = smd 1.27 x 0.635: 1 0.241,-8.496 | smd 0.025 x 0.025: 2 7.417,-5.842
434111043826 = smd 2.3 x 1.5: 1 -3.35,0; 2 3.35,0
CRYSTAL-SMD-2.0X1.6MM = smd 0.75 x 0.7: 1 -0.675,-0.5; 2 0.675,-0.5; 3 0.675,0.5; 4 -0.675,0.5
CRYSTAL-SMD-3.2X1.5MM = smd 1 x 1.8: P$1 -1.25,0; P$2 1.25,0

### Placement (x,y rotation side)
C1  28.42,32.23 90 top
C2  28.89,26.99 90 top
C3  24.77,26.67 0 top
C4  47.94,33.66 270 top
C5  35.56,36.2 270 top
C6  42.89,24.29 270 top
C7  23.1,21.28 180 top
C8  26.48,19.14 180 top
C9  38.73,17.46 90 top
C10  32.38,6.99 270 top
C11  29.84,18.73 270 top
C12  46.35,17.46 270 top
C13  45.09,17.46 270 top
C14  31.11,18.73 90 top
C15  18.41,29.84 90 top
C16  25.43,32.79 180 top
C17  26.04,15.88 180 top
C18  26.04,14.61 180 top
C19  40.01,17.46 270 top
C20  43.81,17.46 270 top
C21  6.35,17.78 0 top
C22  33.68,1.68 180 top
C23  43.81,13.97 90 top
C24  40.64,13.97 90 top
C25  36.04,18.57 90 top
C26  37.31,18.57 90 top
D1  23.18,24.13 90 top
D2  23.18,22.86 90 top
D3  39.98,25.91 270 top
D4  17.9,36.04 270 top
D5  15.88,27.3 90 top
D6  15.88,31.75 90 top
D7  12.7,31.75 90 top
D8  12.7,27.3 90 top
D9  13.43,35.46 180 top
DEBUG1  42.23,2.22 0 top
IC1  32.7,36.2 180 top
IC3  25.08,29.53 180 top
IC4  45.43,24.6 0 top
IC12  34.92,12.86 0 top
JP1  53.34,20 270 bottom
JP2  40.49,34.8 0 top
JP3  53.59,29.37 270 top
JP4  53.34,20 270 top
JP5  31.98,22.55 90 top
JP6  19.84,16.83 90 top
JP7  18.26,16.83 90 top
JP8  16.67,16.83 90 top
JP9  15.08,16.83 90 top
JP10  13.49,16.83 90 top
JP11  11.91,16.83 90 top
JP12  16.67,13.02 90 top
JP13  18.26,13.02 90 top
JP14  19.84,13.02 90 top
L1  33.97,29.53 270 top
L2  3.9nH  [0402']  42.23,13.34 180 top
L3  6.99,33.02 0 top
L4  15nH  [0402']  33.5,18.1 180 top
L5  33.34,19.21 0 top
L6  6.99,26.67 0 top
LED1  2.54,5.08 90 top
LS1  39.22,36.86 0 top
LS2  41.61,36.86 0 top
LS3  23.2,4.45 0 top
Q1  28.89,36.2 180 top
Q2  21.23,32.17 180 top
R1  2.54,3.17 0 top
R2  48.92,22.06 0 top
R3  48.92,23.65 0 top
R4  48.92,26.83 0 top
R5  48.92,25.24 0 top
R6  6.35,19.05 0 top
R7  40.02,31.08 270 top
R8  22.86,36.2 90 top
R9  21.27,36.2 270 top
R11  28.26,24.13 0 top
R12  28.26,22.54 0 top
R14  26.04,36.2 90 top
R15  24.45,36.2 90 top
R16  19.68,36.2 90 top
R49  33.68,4.17 0 top
R60  33.68,2.92 0 top
SENS  26.68,1.84 0 top
TP1  1.91,31.75 0 top
TP2  1.91,27.94 0 top
U$18  53.91,13.37 270 top
UART_INTERFACE  15.56,1.59 0 top
UPDATE  3.81,13.65 90 top
Y1  41.91,17.46 0 top
Y2  28.57,15.24 90 top

### Tracks (layer width: path | path; a pad name or v marks a point on that pad's centre or on a via)
3.3V  (1 unrouted)
  Top 0.406: C5.1 35.56,38.1 35.24,38.42 32.07,38.42 31.75,38.1 IC1.2 | C6.1 42.89,25.58 43.21,25.9 IC4.5
!RESET!  (3 unrouted)
ADC1  (1 unrouted)
  Top 0.203: R9.1 R8.2
AGND  (3 unrouted)
  pour Top (rank 3): -6.62,41.04 57.01,41.04 57.01,20.19 -6.62,20.19
  pour Bottom (rank 3): -5.84,46.95 61.84,46.95 61.84,20.19 -5.84,20.19
ANT
  pour Top (no thermals): 37.38,12.76 39.08,12.76 40.2,13.88 42.13,13.88 42.13,12.36 39.26,12.36 39.1,12.51 37.38,12.51
BUCK-OUT-1  (1 unrouted)
  Top 0.61: D3.C 39.98,30.2 R7.2
BUCK-OUT-2  (2 unrouted)
  Top 0.61: R7.1 40.02,33.33 39.68,33.66 JP2.1 39.68,36.4 39.59,36.49 39.73,36.49
BUCK_EN  (1 unrouted)
DCC
  Top 0.203: L5.1 32.58,19.15 32.24,18.81 32.24,17.58 33.12,16.7 IC12.47
DEC4
  Top 0.203: IC12.46 33.52,16.8 32.92,17.41 L4.2 32.92,18.39 33.23,18.7 33.23,19.71 33.08,19.86 31.29,19.86 31.11,19.68 C14.2
DEC5
  Top 0.203: IC12.1 31.3,15.06 30.8,15.56 30.8,16.99 30.48,17.3 30,17.3 29.84,17.46 C11.2
DEC6
  Top 0.203: IC12.32 39.33,13.46 39.85,13.97 39.85,13.98 39.84,13.99 39.84,14.98 40.1,15.24 45.24,15.24 45.56,15.56 45.56,15.72 45.88,16.03 46.2,16.03 46.35,16.19 C12.2
DEC8
  Top 0.203: IC12.33 39.21,13.86 39.48,14.13 39.48,15.13 39.95,15.6 44.93,15.6 45.09,15.75 C13.2
EN1  (1 unrouted)
EN2  (1 unrouted)
EN_SENS  (1 unrouted)
FB
  Top 0.406: D2.K D1.K 22.43,29.73 23.18,30.48 IC3.4 23.93,31.23 24.58,31.88 C16.2
GND  (via drill 0.31, 0.38)  (1 unrouted)
  Top 0.025: v47.83,6.2 U$18.2
  Top 0.152: v47.82,6.2 v47.83,6.2
  other vias: 46.09,11.56 45.33,11.56 46.09,10.79 46.09,10.03 46.09,9.27 46.09,8.51 46.09,7.75 46.09,6.99 46.09,6.22 46.09,5.46 46.09,4.7 46.09,3.94 46.09,3.17 46.09,14.61 45.33,14.61 46.09,15.37 44.56,11.56 43.8,11.56 43.04,11.56 42.28,11.56 41.52,11.56 40.75,11.56 42.28,14.61 43.04,14.61 41.52,14.61 33.05,14.57 34.92,14.57 36.79,14.57 34.92,12.86 33.05,12.86 33.05,10.99 34.92,10.99 36.79,10.99 36.79,12.86 47.61,16.13 48.37,16.13 49.14,16.13 49.9,16.13 50.66,16.13 51.42,16.13 52.18,16.13 52.95,16.13 53.71,16.13 46.09,2.41 46.09,1.65 46.09,0.89
  pour Bottom: 48.3,-3.8 48.3,12.03 46.79,12.03 46.79,15.88 56.2,15.88 56.2,20 -6.67,20 -6.67,-3.8
  pour Top (isolate 0.076, rank 2): 46.8,15.86 46.8,-4.86 -0.27,-4.86 -0.27,20 55.33,20 55.33,15.86
I2C_SCL  (1 unrouted)
I2C_SDA  (1 unrouted)
  Top 0.203: IC12.38 36.72,16.62 36.04,17.3 C25.1
LED  (1 unrouted)
MIFA
  pour Top (no thermals): 42.33,13.88 45.1,13.88 45.1,12.36 42.33,12.36
N$2
  Top 0.406: IC3.6 23.93,26.68 C3.1
N$3
  Top 0.406: C3.2 25.08,27.2 25.08,29.05 25.56,29.53 IC3.2
  pour Top: 25.56,29.84 28.89,29.84 29.53,30.48 29.53,33.18 30.32,33.97 35.24,33.97 35.4,33.81 35.4,31.27 35.08,30.96 31.11,30.96 30.91,30.91 29.21,29.21 25.56,29.21
N$4  (1 unrouted)
N$5  (via drill 0.35)
  Top 0.203: Q2.3 20.28,34.09 20.64,34.45 24.29,34.45 24.45,34.61 R15.1 24.45,35.46
  Bottom 0.203: R14.2 24.45,35.46 R15.1
  other vias: 24.45,35.34 26.04,37.05
N$6  (1 unrouted)
N$8
  Top 0.203: R4.1 R5.1 47.47,25.24 46.8,25.9 IC4.4
N$9
  Top 0.203: IC4.3 46.96,23.3 47.31,23.65 R3.1 48.18,23.65 R2.2
N$12
  Top 0.813: TP2.TP 4.49,25.36 L6.1
N$13
  pour Top: 28.26,26.83 31.11,26.83 32.23,27.94 36.35,27.94 38.58,25.72 41.27,25.72 41.43,25.56 41.43,22.86 41.27,22.7 38.58,22.7 36.35,24.92 28.26,24.92 27.78,25.4 27.78,26.35
N$14
  Top 0.813: TP1.TP 4.78,31.75 L3.1
N$15  (via drill 0.35)
  Top 0.813: D5.A 15.88,29.37 | 15.88,29.37 D6.C | 15.88,29.37 14.92,29.37 v14.45,29.84 v14.45,30.64 | L3.2 9.8,34.33 10.79,33.34 v10.95,33.34 v11.74,33.34
  Bottom 0.813: v14.45,29.84 v14.45,30.64 14.45,32.7 13.81,33.34 v11.75,33.34 v11.74,33.34 v10.95,33.34
N$16
  Top 0.813: D8.A 12.7,29.37 | 12.7,29.37 D7.C | L6.2 10.54,29.37 12.7,29.37
N$20  (1 unrouted)
N$50
  Top 0.203: IC12.37 37.12,16.64 37.31,16.83 C26.1
N$53
  Top 0.203: L4.1 34.08,19.19 L5.2
P00  (2 unrouted)
P01  (2 unrouted)
P02  (1 unrouted)
P03  (1 unrouted)
P04  (1 unrouted)
P05  (1 unrouted)
P06  (1 unrouted)
P07  (1 unrouted)
P08  (1 unrouted)
P11  (1 unrouted)
P12  (1 unrouted)
P13  (1 unrouted)
P14  (1 unrouted)
P16  (3 unrouted)
P19  (1 unrouted)
PG  (1 unrouted)
PWM-CHG  (2 unrouted)
SWDCLK  (2 unrouted)
SWDIO  (1 unrouted)
SWO/TDO  (1 unrouted)
V-ICHG  (2 unrouted)
  Top 0.203: IC4.1 44.48,24 44.93,24.45 49.53,24.45 49.77,24.69 R5.2
V-VCHG  (4 unrouted)
VCHG  (3 unrouted)
  Top 0.61: JP2.3 41.3,35.43 41.98,36.1 | 41.98,36.1 41.98,36.49 | 41.98,36.1 42.07,36.2 C4.+
VDD_BLE  (9 unrouted)
  Top 0.203: IC12.36 38.39,15.06 38.42,15.08 38.42,15.57 38.73,15.89 C9.1
VDD_SENS  (1 unrouted)
VDD_WPT  (2 unrouted)
  Top 0.203: R8.1 22.86,36.04 | 22.86,36.04 22.7,36.2 19.84,36.2 19.68,36.04 R16.1 | R14.1 26.04,36.04 25.88,36.2 23.02,36.2 22.86,36.04
  Top 0.61: Q2.4 20.28,29.17 19.55,28.45 C15.1
  Top 0.813: D8.C D5.C 17.51,26.55 18.57,27.62 18.57,28.29 C15.1
VIN  (via drill 0.35)
  Top 0.61: IC3.3 v26.99,30.48 28.1,30.48 28.42,30.8 C1.1 | IC1.1 33.66,36.35 34.13,35.88 v34.13,35.72 v34.13,34.92
  Bottom 0.61: v26.99,30.48 v27.78,30.48 28.1,30.48 28.42,30.8 28.42,33.5 29.53,34.61 33.81,34.61 v34.13,34.92 v34.13,35.72 | v26.99,30.48 | v23.02,33.02 v23.02,32.23 24.77,30.48 v26.99,30.48
  pour Top: 20.8,33.97 20.8,30.32 20.95,30.16 22.23,30.16 23.34,31.27 23.34,33.97 23.18,34.13 20.95,34.13
VMEAS  (3 unrouted)
  Top 0.61: JP2.2 40.49,36.17 40.49,37.16 | 40.49,37.16 40.64,37.31 41.16,37.31 41.23,37.23 | 40.49,37.16 40.47,37.16 39.69,37.94 39.05,37.94 38.85,37.74 38.85,37.23
WAKE-UP  (1 unrouted)
  Top 0.203: R16.2 17.99,37.05 D4.C
XC1
  Top 0.203: IC12.34 38.94,14.26 39.13,14.45 39.13,15.27 39.81,15.95 43.57,15.95 43.81,16.19 C20.2 43.21,17.41 43.21,17.42 42.67,17.96 Y1.3
XC2
  Top 0.203: Y1.1 40.16,16.96 C19.2 40.01,16.47 39.85,16.31 39.66,16.31 38.77,15.42 38.77,14.76 38.66,14.66 IC12.35

### Text on the board
tPlace: Jarne Van Mulders | NR012
tNames: Power Receiving Unit | V1.0